# Altium schematic sheet Fri3D_2018_POWER_01.SchDoc: Fri3D Badge 2018
size A3; Date: 13/06/2018; DrawnBy: Wim Van Gool; DocumentNumber: 4; Revision: 01; SheetNumber: 4; SheetTotal: 4
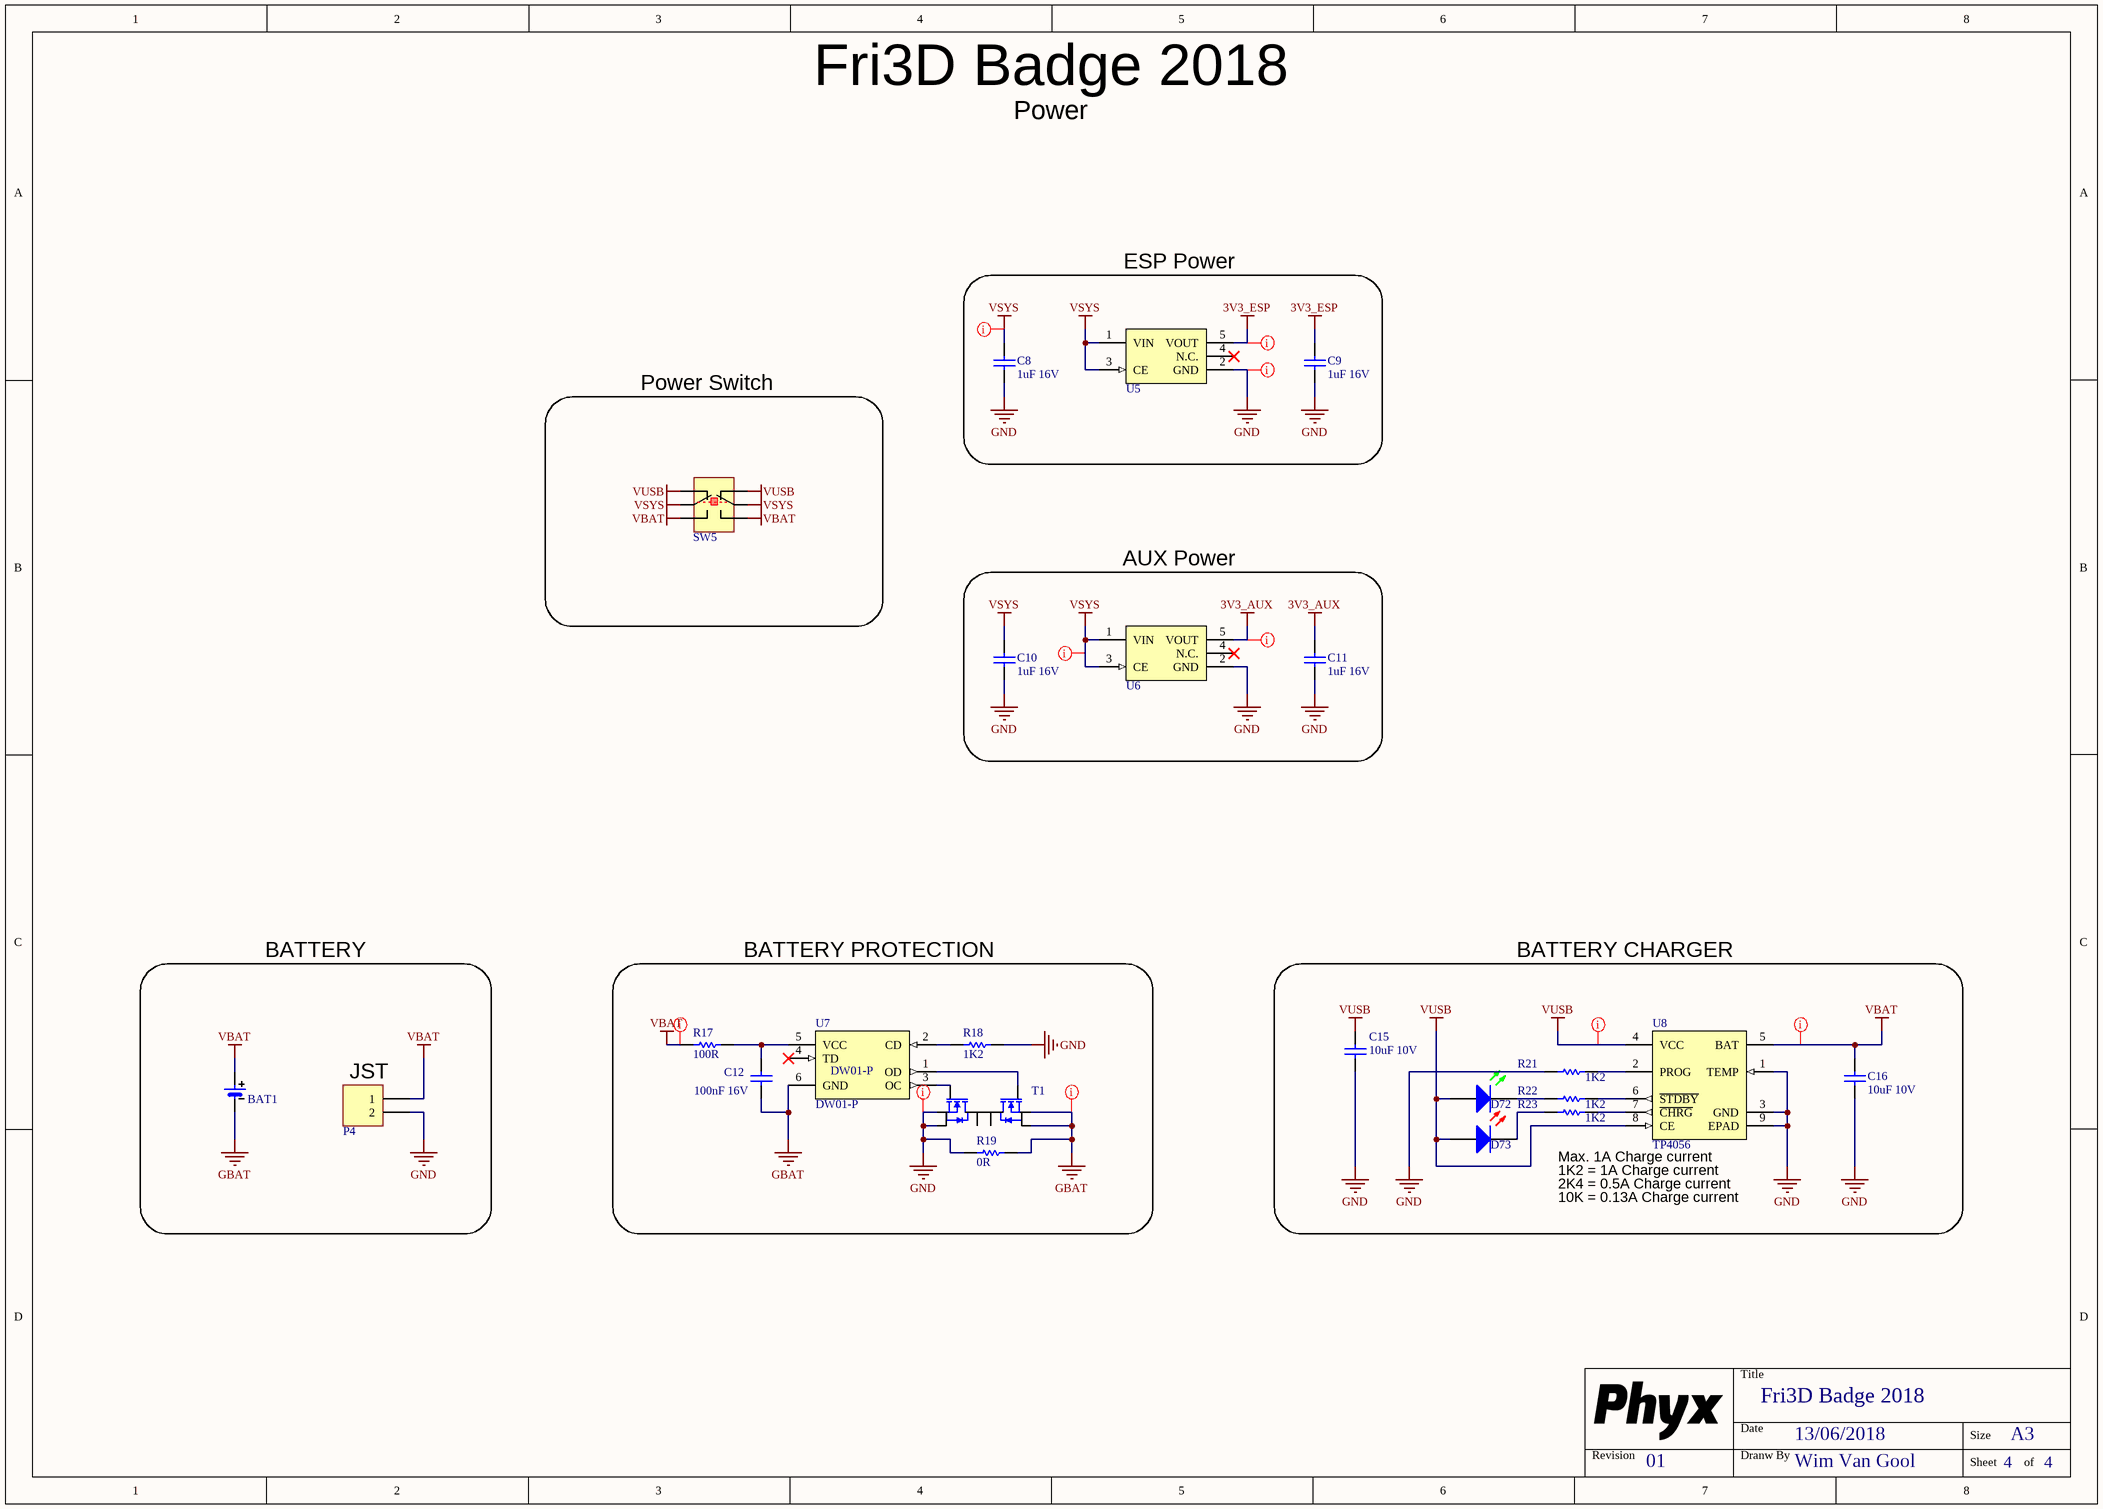
[diagram p0: Fri3D_2018_POWER_01.SchDoc]

## Parts
BAT1  18650 Battery holder  [MPD_BH-18650-PC]  (value not drawn)
C8  value 1uF 16V  [C0603_N]  (hidden comment: CAP_CERAMIC)
C9  value 1uF 16V  [C0603_N]  (hidden comment: CAP_CERAMIC)
C10  value 1uF 16V  [C0603_N]  (hidden comment: CAP_CERAMIC)
C11  value 1uF 16V  [C0603_N]  (hidden comment: CAP_CERAMIC)
C12  value 100nF 16V  [C0603_N]
C15  value 10uF 10V  [C0805_N]  (hidden comment: CAP_CERAMIC)
C16  value 10uF 10V  [C0805_N]  (hidden comment: CAP_CERAMIC)
D72  Default 0805 Green LED  [LED_0805_GR]  (value not drawn)
D73  Default 0805 Red LED  [LED_0805_RD]  (value not drawn)
P4  Header 2.0mm Shrouded 2  [WE_620102131822]  (value not drawn)
R17  value 100R  [R0603_N]  (hidden comment: RESISTOR)
R18  value 1K2  [R0603_N]  (hidden comment: RESISTOR)
R19  value 0R  [R0603_N]
R21  value 1K2  [R0603_N]  (hidden comment: RESISTOR)
R22  value 1K2  [R0603_N]  (hidden comment: RESISTOR)
R23  value 1K2  [R0603_N]  (hidden comment: RESISTOR)
SW5  Mini slide switch 2P2T  [MSS22D18]  (value not drawn)
T1  Dual N-Ch MOSFET Common Drain  [TSSOP_8_65P]  (value not drawn)
U5  3V3 LDO 700mA 50mV  [SOT23-5]  (value not drawn)
U6  3V3 LDO 700mA 50mV  [SOT23-5]  (value not drawn)
U7  value DW01-P  [SOT23-6]  (hidden comment: DW01-P single cell lithium protection)
U8  value TP4056  [SOIC_N_8_TH]  (hidden comment: Single Cell LiIon charger max 1A)

## Blocks framed on the sheet
ESP Power: C8 C9 U5
Power Switch: SW5
AUX Power: C10 C11 U6
BATTERY PROTECTION: C12 R17-R19 T1 U7
BATTERY CHARGER: C15 C16 D72 D73 R21-R23 U8

## Nets
3V3_AUX: C11.1 U6.5(VOUT)
3V3_ESP: C9.1 U5.5(VOUT)
GBAT: BAT1.2 C12.2 R19.1 T1.2(S1) T1.3(S1) U7.6(GND)
GND: C8.2 C9.2 C10.2 C11.2 C15.2 C16.2 P4.2 R18.2 R19.2 R21.2 T1.6(S2) T1.7(S2) U5.2(GND) U6.2(GND) U8.1(TEMP) U8.3(GND) U8.9(EPAD)
VBAT: BAT1.1 C16.1 P4.1 R17.1 SW5.5 SW5.6 U8.5(BAT)
VSYS: C8.1 C10.1 SW5.3 SW5.4 U5.1(VIN) U5.3(CE) U6.1(VIN) U6.3(CE)
VUSB: C15.1 D72.1(A) D73.1(A) SW5.1 SW5.2 U8.4(VCC) U8.8(CE)
NetC12_1: C12.1 R17.2 U7.5(VCC)
NetD72_2: D72.2(K) R22.1
NetD73_2: D73.2(K) R23.1
NetR18_1: R18.1 U7.2(CD)
NetR21_1: R21.1 U8.2(PROG)
NetR22_2: R22.2 U8.6(~{STDBY})
NetR23_2: R23.2 U8.7(~{CHRG})
NetT1_4: T1.4(G1) U7.1(OD)
NetT1_5: T1.5(G2) U7.3(OC)

Not connected (* = marked no-connect by the designer): T1 1(D1) 8(D2); U5 4(N.C.)*; U6 4(N.C.)*; U7 4(TD)*

## Layout directives
net class POWER: 3V3_AUX, 3V3_ESP, GBAT, GND, VBAT, VSYS, VUSB

## Notes on the sheet
- Fri3D Badge 2018
- Power
- BATTERY
- (near P4) JST
- 1K2 = 1A Charge current
- 2K4 = 0.5A Charge current
- Max. 1A Charge current
- 10K = 0.13A Charge current
- Title
- Revision
- Date
- Dranw By
- Size
- A3
- Sheet
- of

## Library data of the parts
BAT1 = 18650 Battery holder BH-18650-PC: =Description; Value: BH-18650-PC; Supplier 1: Digikey
C8-C11 = CAP # 1uF 16V 0603: Capacitor Ceramic; Supplier 1: Farnell; Supplier Part Number 1: 2320814
C12 = CAP # 100nF 16V 0603: Capacitor Ceramic
C15 C16 = CAP # 10uF 10V 0805: Capacitor Ceramic; Supplier 1: Farnell; Supplier Part Number 1: 2320859
D72 = LED # Green 0805: =Description; Supplier 1: Farnell; Supplier Part Number 1: 2099239
D73 = LED # Red 0805: =Description; Supplier 1: Farnell; Supplier Part Number 1: 2099236
P4 = HDR # SHR 2.0mm 2way - 620102131822: Value: 620102131822; Supplier 1: Wurth
R17 = RES # 100R 0603
R18 R21-R23 = RES # 1K2 0603
R19 = RES # 0R 0603: Supplier 1: Farnell; Supplier Part Number 1: 2447743
SW5 = SW # 2P2T mini slide MSS22D18: Value: MSS22D18; Supplier 1: AliExpress; Supplier Part Number 1: MSS22D18
T1 = FS8205A Dual N-Ch common Drain for DW01-P: =Description; Value: FS8205A; Supplier 1: AliExpress; Supplier Part Number 1: FS8205A
U5 U6 = LDO # 3V3 XC6210B33: =Designator; Value: XC6210B332MR; Supplier 1: Farnell; Supplier Part Number 1: 1057803
U7 = PWR # DW01-P Lithium protection: =Description; Supplier 1: Aliexpress; Supplier Part Number 1: DW01-P
U8 = CHG # TP4056 LiIon 1A: =Description; Supplier 1: Aliexpress; Supplier Part Number 1: TP4056